# Altium project PCB_Project.PrjPcb
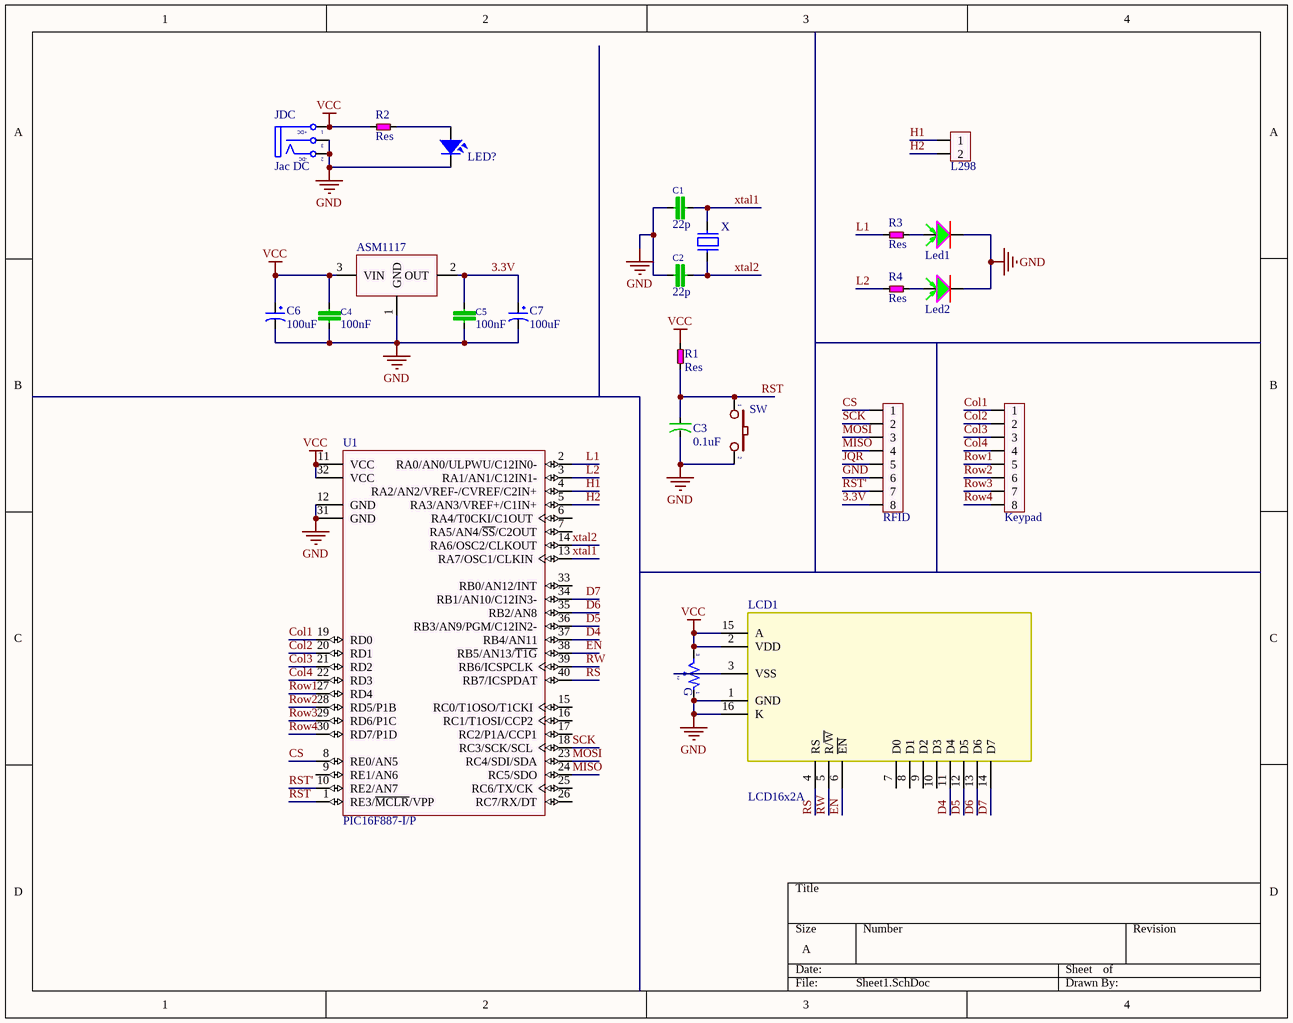
[diagram p0: Sheet1.SchDoc]
1 sheet, 24 parts. Net scope: global (net labels, ports and power ports of the same name join across sheets).
Board file: PCB1.PcbDoc

## Sheet Sheet1.SchDoc
size A

### Parts
ASM1117  (no value)  [SOT223]
C1  22p  [C025-025,040]
C2  22p  [C025-025,040]
C3  0.1uF  [CA-040,015]
C4  100nF  [C-0805]
C5  100nF  [C-0805]
C6  100uF  [CP1/2.5]
C7  100uF  [CP1/2.5]
JDC  Jac DC  [DC-IN]
Keypad  JP8  [JP8-C1T]  (value not drawn)
L298  Header2  [Header2]  (value not drawn)
LCD1  LCD16x2A  [LCD16X2]
Led1  LEDA  [L-5G]  (value not drawn)
Led2  LEDA  [L-5R]  (value not drawn)
LED?  LED  [LED-5-Green]  (value not drawn)
R1  Res  [R-025,100]
R2  Res  [R-025,100]
R3  Res  [R-025,100]
R4  Res  [R-025,100]
RFID  JP8  [JP8-C1T]  (value not drawn)
SW  (no value)  [SW2]
U1  PIC16F887-I/P  [DIP40Q]
X  (no value)  [XT2]
  (no value)  [VR-S2]

### Nets
GND: ASM1117.1(GND) C1.2 C2.2 C3.2 C4.2 C5.2 C6.2 C7.2 JDC.2(TN) JDC.3(S) LCD1.1(GND) LCD1.16(K) Led1.2(K) Led2.2(K) LED?.2 RFID.6 SW.2 U1.12(GND) U1.31(GND) .1
VCC: ASM1117.3(VIN) C4.1 C6.1 JDC.1(T) LCD1.2(VDD) LCD1.15(A) R1.1 R2.1 U1.11(VCC) U1.32(VCC) .3
3.3V: ASM1117.2(OUT) C5.1 C7.1 RFID.8
Col1: Keypad.1 U1.19(RD0)
Col2: Keypad.2 U1.20(RD1)
Col3: Keypad.3 U1.21(RD2)
Col4: Keypad.4 U1.22(RD3)
CS: RFID.1 U1.8(RE0/AN5)
D4: LCD1.11(D4) U1.37(RB4/AN11)
D5: LCD1.12(D5) U1.36(RB3/AN9/PGM/C12IN2-)
D6: LCD1.13(D6) U1.35(RB2/AN8)
D7: LCD1.14(D7) U1.34(RB1/AN10/C12IN3-)
EN: LCD1.6(~{EN}) U1.38(RB5/AN13/~{T1G})
H1: L298.1 U1.4(RA2/AN2/VREF-/CVREF/C2IN+)
H2: L298.2 U1.5(RA3/AN3/VREF+/C1IN+)
JQR: RFID.5
L1: R3.1 U1.2(RA0/AN0/ULPWU/C12IN0-)
L2: R4.1 U1.3(RA1/AN1/C12IN1-)
MISO: RFID.4 U1.24(RC5/SDO)
MOSI: RFID.3 U1.23(RC4/SDI/SDA)
Row1: Keypad.5 U1.27(RD4)
Row2: Keypad.6 U1.28(RD5/P1B)
Row3: Keypad.7 U1.29(RD6/P1C)
Row4: Keypad.8 U1.30(RD7/P1D)
RS: LCD1.4(RS) U1.40(RB7/ICSPDAT)
RST: C3.1 R1.2 SW.1 U1.1(RE3/~{MCLR}/VPP)
RST': RFID.7 U1.10(RE2/AN7)
RW: LCD1.5(R/~{W}) U1.39(RB6/ICSPCLK)
SCK: RFID.2 U1.18(RC3/SCK/SCL)
xtal1: C1.1 U1.13(RA7/OSC1/CLKIN) X.2
xtal2: C2.1 U1.14(RA6/OSC2/CLKOUT) X.1
NetLCD1_3: LCD1.3(VSS) .2
NetLed1_1: Led1.1(A) R3.2
NetLed2_1: Led2.1(A) R4.2
NetLED?_1: LED?.1 R2.2

Not connected (* = marked no-connect by the designer): LCD1 7(D0) 8(D1) 9(D2) 10(D3); U1 6(RA4/T0CKI/C1OUT) 7(RA5/AN4/~{SS}/C2OUT) 9(RE1/AN6) 15(RC0/T1OSO/T1CKI) 16(RC1/T1OSI/CCP2) 17(RC2/P1A/CCP1) 25(RC6/TX/CK) 26(RC7/RX/DT) 33(RB0/AN12/INT)

### Notes on the sheet
- (in symbol DCIN) +DC; -DC
- (in symbol VR-S) G

### Library data of the parts
ASM1117 = AMS1117-3V3: 800mA Low-Dropout Linear Regulator
C1 C2 C4 C5 = CN: CAP CER 0.047UF 25V X7R 0402
C3 = CN-ALU-DIP: Cap Aluminum Lytic 2200uF 25V 20% (12.5 X 25mm) Radial 5mm 1090mA 2000h 105C Bulk
C6 C7 = CP2: C 47uF/50V , 220uF/16V; Value: 47uF/16 - 50V; Description 1: 470uF/6,3V - 330uF/10V - 220uF/16V; Description 2: 100uF/25V - 35V - 47uF/50V - 22uF/100V; Description 3: 33uF => 47uF/63V - 1uF => 4,7uF/160V; Description 4: 1uF => 2,2uF/250V - 1uF/350V
JDC = DCIN: Jac DC input; Value: Jac DC
Keypad RFID = JP8: WR-PHD 2.54 mm Angled Socket Header
L298 = Header2: Header IDC, 2 x 1 Pin Vertical 2.54mm Pitch (Non-Boxed, Male)
LCD1 = LCD16x2: LCD dipslay 16 char, 2 line; Value: LCD16x2A
Led1 Led2 = LEDA: DIALIGHT         5988270107F            LED, Green, SMD, 20 mA, 2 V, 570 nm
LED? = LED: LED Single colour Green and Red; Value: LED 3 ly Single Colour
R1-R4 = Res: Thin Film Resistors - SMD 1/4W Regular 2.4Kohm 0.1% 25ppm
SW = SW2: Switch button 2 pin; Value: SW chip 2 pin
U1 = PIC16F887-I/P: 8-bit Microcontrollers - MCU 14KB Flash 368 RAM 36 I/O
X = XT2: 20MHz ±20ppm Crystal 18pF 40 Ohm -20°C ~ 70°C  Surface Mount HC49/US
 = VR-S: Var Resistor